# EAGLE schematic Circuito (EAGLE 9.6.2)
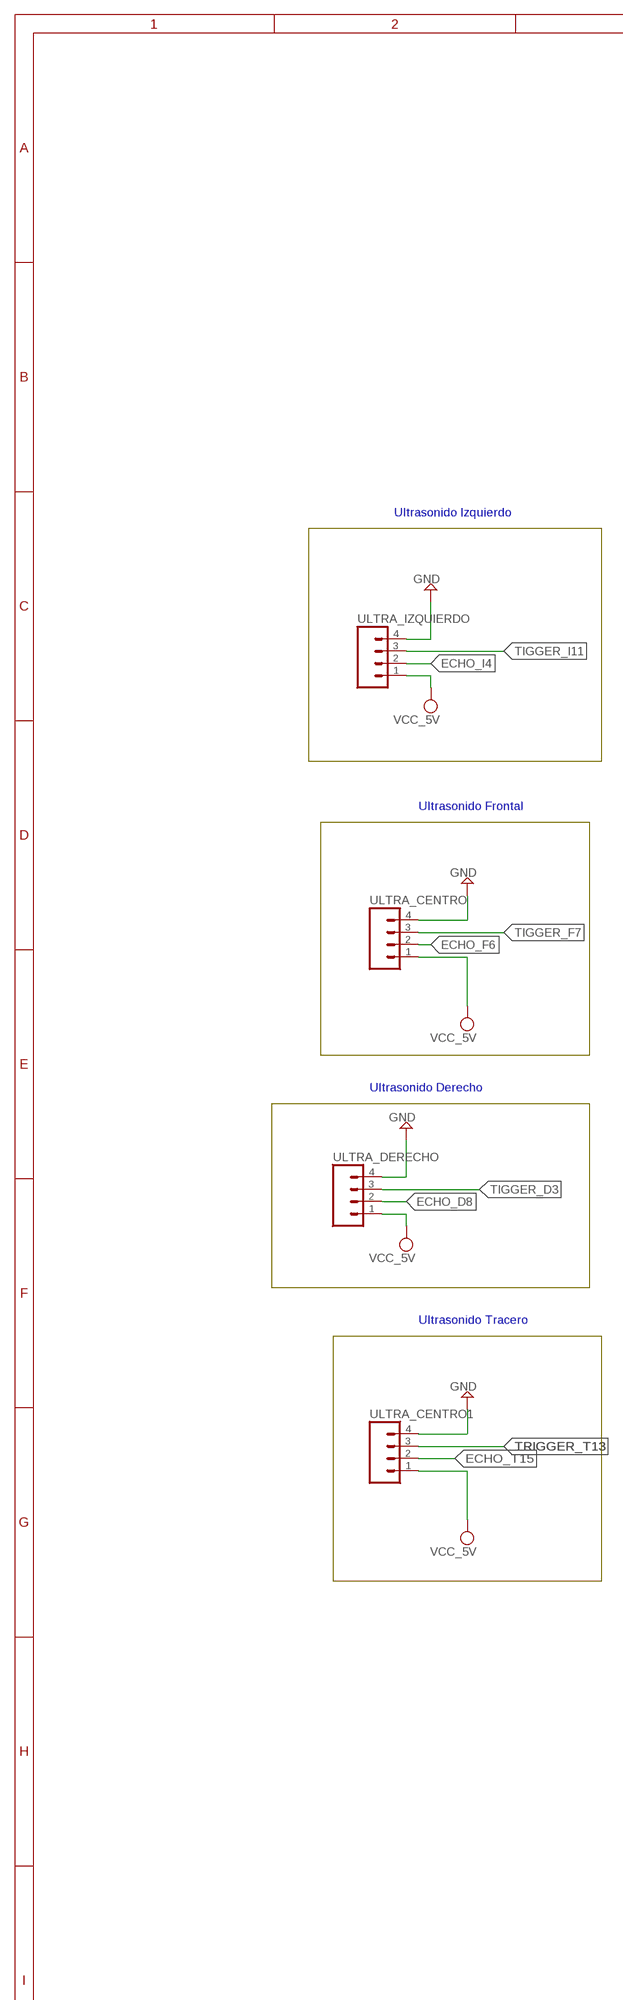
[diagram p0: schematic, sheet 1, part 1 of 2]
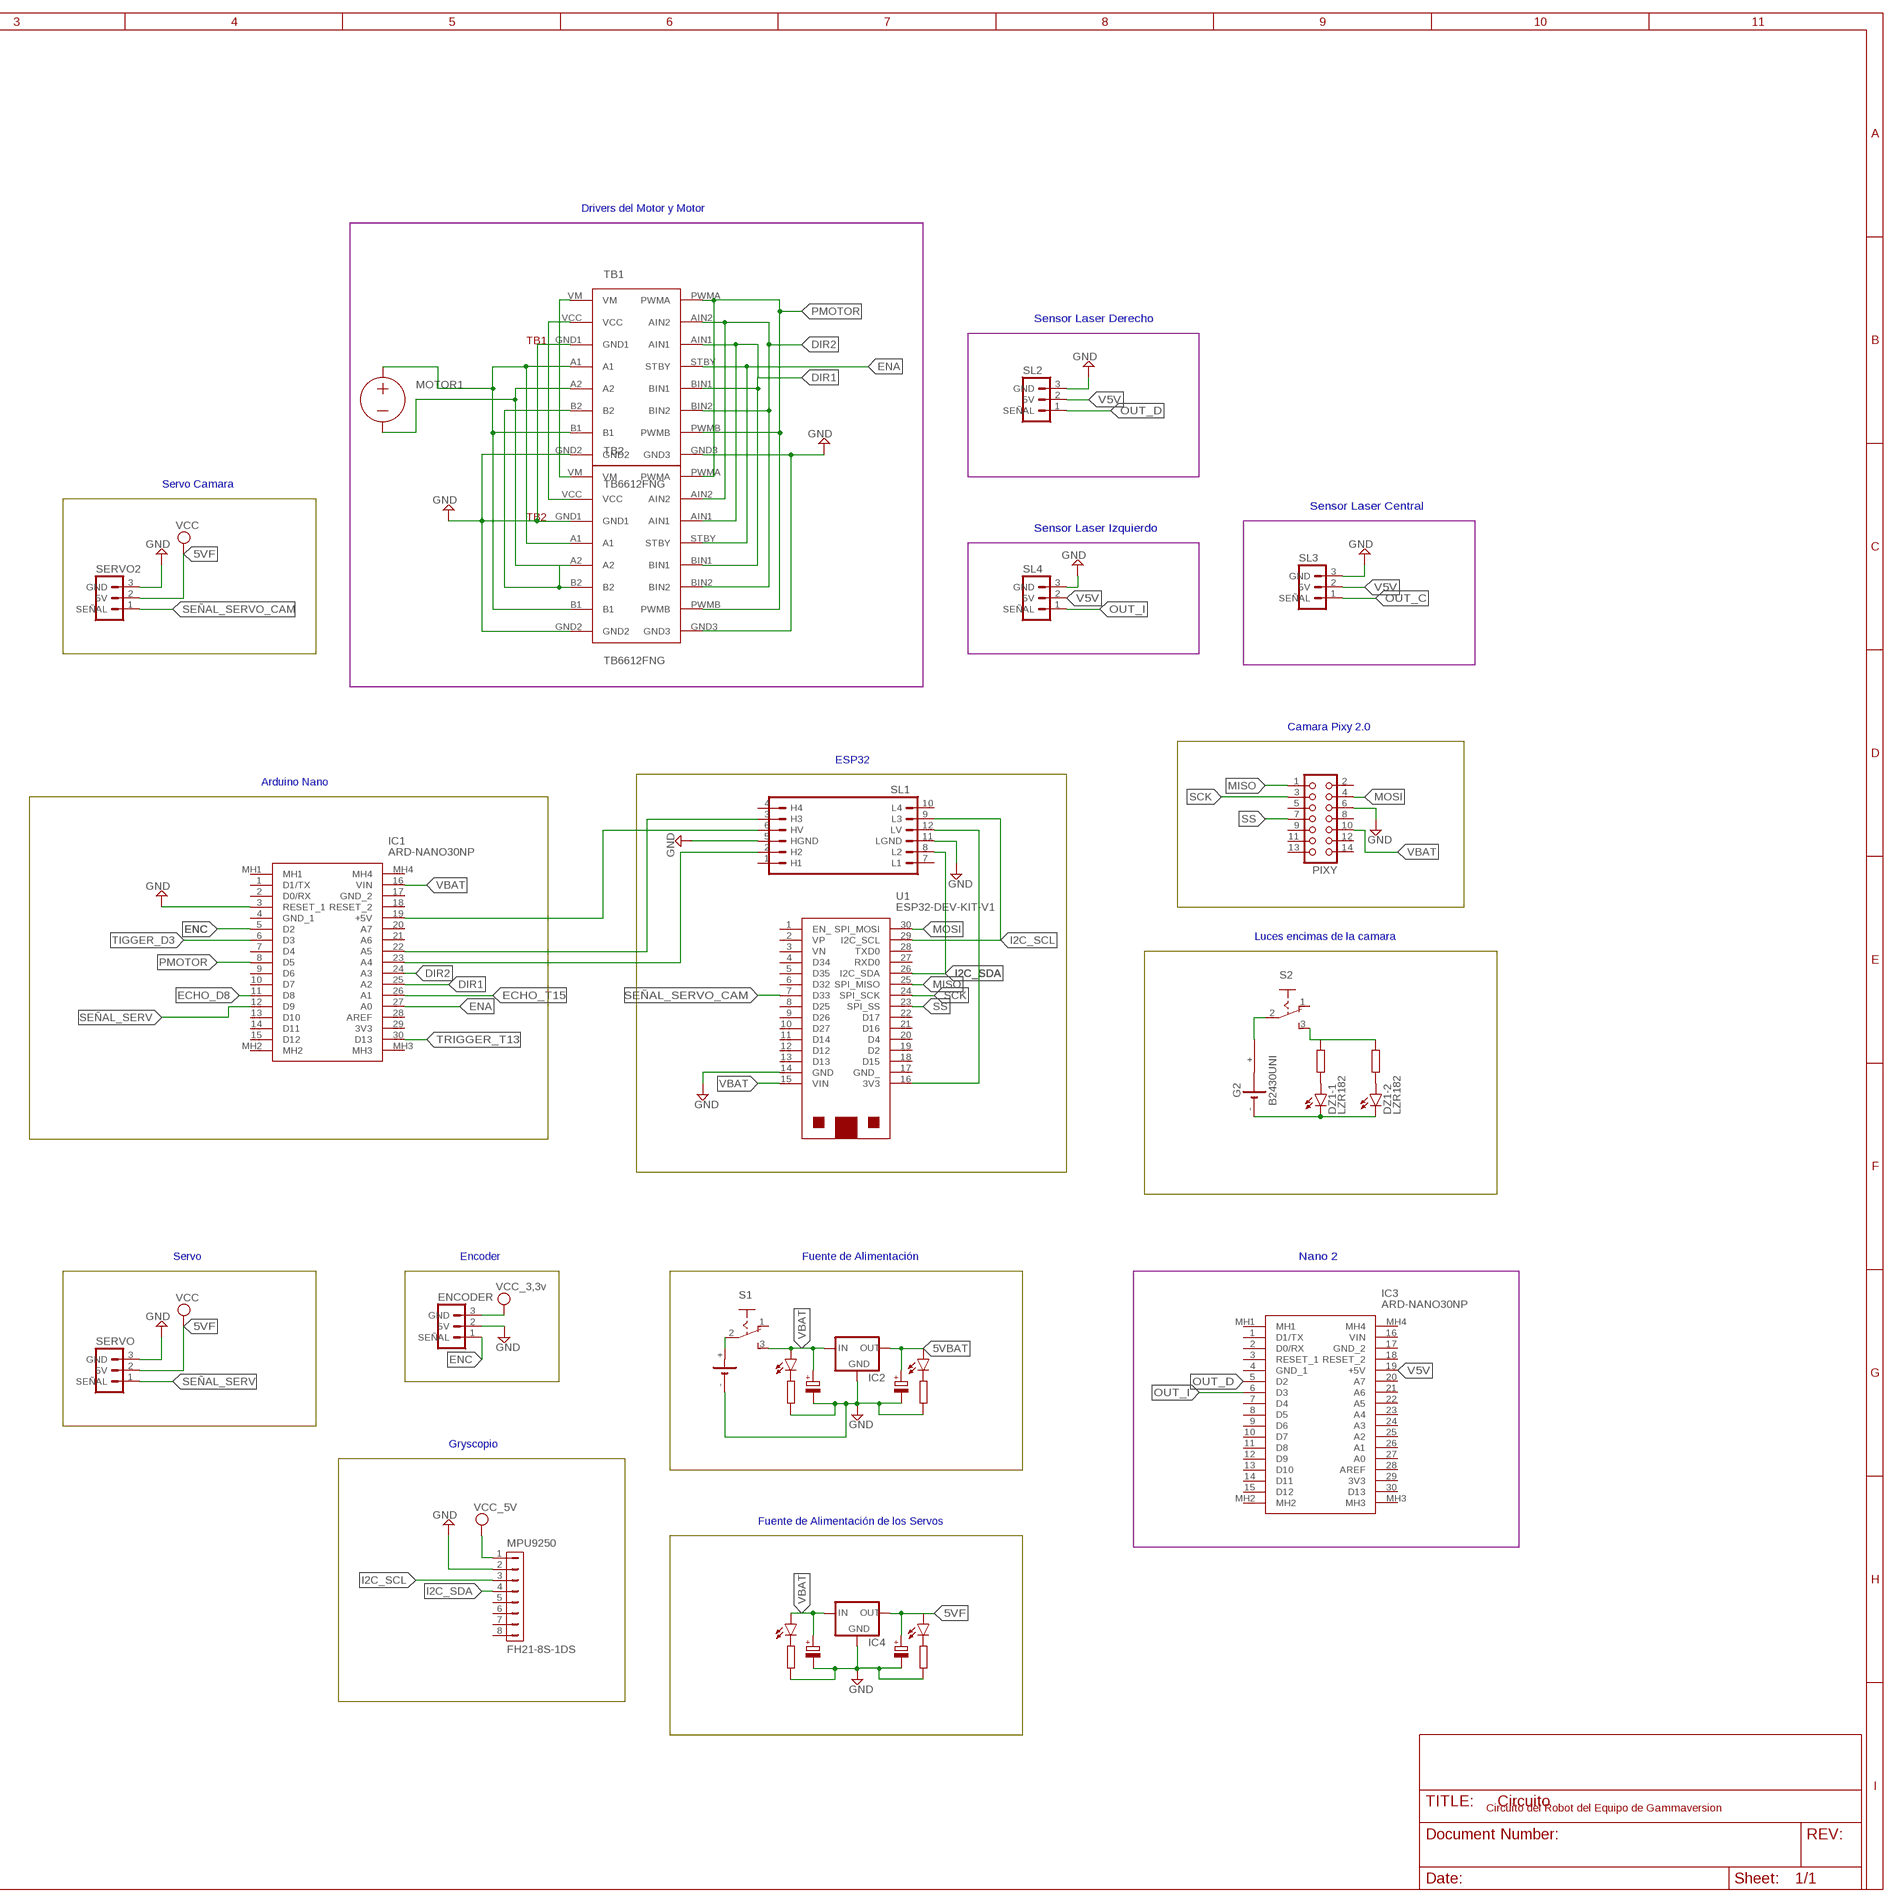
[diagram p1: schematic, sheet 1, part 2 of 2]

## Parts
D1  U57X32  [U57X32]
D2  U57X32  [U57X32]
D3  U57X32  [U57X32]
D4  U57X32  [U57X32]
DZ1  LZR182  [LZR182]
ENCODER  M03  [03P]
G1  CH291-1220LF  [CH291-1220LF]
G2  B2430UNI  [B2430UNI]
IC1  ARD-NANO30NP  [ARDNANO30NP]
IC2  78XXS  [78XXS]
IC3  ARD-NANO30NP  [ARDNANO30NP]
IC4  78XXS  [78XXS]
MOTOR1  VOLTAGE  (no package)
MPU9250  FH21-8S-1DS  [FH21-8S-1DS]
PIXY  CON14  [CON14]
S1  M251  [M251]
S2  M251  [M251]
SERVO  CON_SERVO  [03P]
SERVO2  CON_SERVO  [03P]
SL1  I2C_LEVELCONVERTER  [12P]
SL2  M03  [03P]
SL3  M03  [03P]
SL4  M03  [03P]
TB1  TB6612FNG  [TB6612FNG]
TB2  TB6612FNG  [TB6612FNG]
U1  ESP32-DEV-KIT-V1  [DIP2600W100P254L5400H500Q38N]
ULTRA_CENTRO  M04  [04P]
ULTRA_CENTRO1  M04  [04P]
ULTRA_DERECHO  M04  [04P]
ULTRA_IZQUIERDO  M04  [04P]

## Nets
5VBAT: D2.A D4.A IC2.OUT IC4.OUT
DIR1: IC1.25(A2) TB1.AIN1 TB1.BIN1 TB2.AIN1 TB2.BIN1
DIR2: IC1.24(A3) TB1.AIN2 TB1.BIN2 TB2.AIN2 TB2.BIN2
ECHO_D8: ULTRA_DERECHO.2
ECHO_F6: ULTRA_CENTRO.2
ECHO_I4: ULTRA_IZQUIERDO.2
ECHO_T15: ULTRA_CENTRO1.2
ENA: IC1.27(A0) TB1.STBY TB2.STBY
ENC: ENCODER.1(SEÑAL) IC1.5(D2)
GND: ENCODER.2(5V) G1.- IC1.3(RESET_1) IC2.GND IC4.GND MPU9250.2 PIXY.6(GND) SERVO2.3(GND) SERVO.3(GND) SL1.5(HGND) SL1.11(LGND) SL2.3(GND) SL3.3(GND) SL4.3(GND) TB1.GND1 TB1.GND2 TB1.GND3 TB2.GND1 TB2.GND2 TB2.GND3 U1.14(GND) ULTRA_CENTRO1.4 ULTRA_CENTRO.4 ULTRA_DERECHO.4 ULTRA_IZQUIERDO.4
I2C_SCL: MPU9250.3 SL1.9(L3) U1.29(I2C_SCL)
I2C_SDA: MPU9250.4 SL1.8(L2) U1.26(I2C_SDA)
MISO: PIXY.1(SPI_MISO) U1.25(SPI_MISO)
MOSI: PIXY.4(SPI_MOSI) U1.30(SPI_MOSI)
N$1: DZ1.K1(-1:C) DZ1.K2(-2:C) G2.-
N$2: IC1.6(D3)
N$3: IC1.22(A5) SL1.3(H3)
N$4: IC1.11(D8)
N$5: IC1.23(A4) SL1.2(H2)
N$8: IC1.30(D13)
N$10: G2.+ S2.2(P)
N$11: SL1.12(LV) U1.16(3V3)
N$12: IC1.19(+5V) SL1.6(HV)
N$13: S2.3(S)
N$14: IC1.26(A1)
N$15: IC3.6(D3)
N$16: U1.7(D33)
N$17: TB1.VM TB2.VM
N$18: TB1.VCC TB2.VCC
N$21: MOTOR1.- TB1.A2 TB1.B2 TB2.A2 TB2.B2
N$23: MOTOR1.+ TB1.A1 TB1.B1 TB2.A1 TB2.B1
OUT_C: SL3.1(SEÑAL)
OUT_D: SL2.1(SEÑAL)
OUT_I: SL4.1(SEÑAL)
PMOTOR: IC1.8(D5) TB1.PWMA TB1.PWMB TB2.PWMA TB2.PWMB
SCK: PIXY.3(SPI_SCK) U1.24(SPI_SCK)
SEÑAL_SERV: IC1.12(D9) SERVO.1(SEÑAL)
SEÑAL_SERVO_CAM: SERVO2.1(SEÑAL)
SS: PIXY.7(SPI_SS) U1.23(SPI_SS)
TIGGER_D3: ULTRA_DERECHO.3
TIGGER_F7: ULTRA_CENTRO.3
TIGGER_I11: ULTRA_IZQUIERDO.3
TRIGGER_T13: ULTRA_CENTRO1.3
V5V: SL2.2(5V) SL3.2(5V)
VBAT: D1.A D3.A G1.+ IC1.16(VIN) IC2.IN IC4.IN PIXY.10(VIN) S1.2(P) S1.3(S) U1.15(VIN)
VCC_5V_SERVO: ENCODER.3(GND) MPU9250.1 SERVO2.2(5V) SERVO.2(5V) ULTRA_CENTRO1.1 ULTRA_CENTRO.1 ULTRA_DERECHO.1 ULTRA_IZQUIERDO.1 ; supply symbol labelled VCC_3,3v, VCC_5V, VCC
Unconnected: D1.K(C) D2.K(C) D3.K(C) D4.K(C) DZ1.A1(-1:A) DZ1.A2(-2:A) G2.+@1(+) G2.+@2(+) G2.+@3(+) G2.+@4(+) G2.-@1(-) IC1.1(D1/TX) IC1.2(D0/RX) IC1.4(GND_1) IC1.7(D4) IC1.9(D6) IC1.10(D7) IC1.13(D10) IC1.14(D11) IC1.15(D12) IC1.17(GND_2) IC1.18(RESET_2) IC1.20(A7) IC1.21(A6) IC1.28(AREF) IC1.29(3V3) IC1.MH1 IC1.MH2 IC1.MH3 IC1.MH4 IC3.1(D1/TX) IC3.2(D0/RX) IC3.3(RESET_1) IC3.4(GND_1) IC3.5(D2) IC3.7(D4) IC3.8(D5) IC3.9(D6) IC3.10(D7) IC3.11(D8) IC3.12(D9) IC3.13(D10) IC3.14(D11) IC3.15(D12) IC3.16(VIN) IC3.17(GND_2) IC3.18(RESET_2) IC3.19(+5V) IC3.20(A7) IC3.21(A6) IC3.22(A5) IC3.23(A4) IC3.24(A3) IC3.25(A2) IC3.26(A1) IC3.27(A0) IC3.28(AREF) IC3.29(3V3) IC3.30(D13) IC3.MH1 IC3.MH2 IC3.MH3 IC3.MH4 MPU9250.5 MPU9250.6 MPU9250.7 MPU9250.8 PIXY.2(5V) PIXY.5(12C_SCL) PIXY.8(ANAOUT) PIXY.9(I2C_SDA) PIXY.11 PIXY.12 PIXY.13 PIXY.14 S1.1(O) S2.1(O) SL1.1(H1) SL1.4(H4) SL1.7(L1) SL1.10(L4) SL4.2(5V) U1.2(VP) U1.3(VN) U1.4(D34) U1.5(D35) U1.6(D32) U1.8(D25) U1.9(D26) U1.10(D27) U1.11(D14) U1.12(D12) U1.18(D15) U1.19(D2) U1.20(D4) U1.21(D16) U1.22(D17) U1.27(RXD0) U1.28(TXD0)

## Notes on the sheet
- Drivers del Motor y Motor
- Sensor Laser Derecho
- Ultrasonido Izquierdo
- Servo Camara
- Sensor Laser Central
- Sensor Laser Izquierdo
- Ultrasonido Frontal | Camara Pixy 2.0
- ESP32
- Arduino Nano
- Luces encimas de la camara
- Ultrasonido Derecho
- Ultrasonido Tracero
- Servo | Encoder | Fuente de Alimentación | Nano 2
- Gryscopio
- Fuente de Alimentación de los Servos
- Circuito del Robot del Equipo de Gammaversion

## Power pins joined to a net without a drawn wire
D13: U1.13(D13)
EN_: U1.1(EN_)
GND_: U1.17(GND_)

## Library data of the parts
D1-D4 = led:U57X32: LED rectangle, 5.7 x 3.2 mm
DZ1 = led:LZR182: LED BLOCK 2 LEDs, Siemens
ENCODER SL2-SL4 = con-amp-quick:M03: AMP QUICK CONNECTOR; OC_FARNELL: unknown; OC_NEWARK: unknown
G1 = battery:CH291-1220LF: Battery Holder, SMT, 12mm multicomp PART NO. CH291-1220LF Source: Data sheet <http://www.farnell.com/datasheets/1505860.pdf>
G2 = battery:B2430UNI: LI BATTERY
IC1 IC3 = ARD-NANO30NP:ARD-NANO30NP: Development Boards & Kits - AVR Arduino Nano 3.1 W/ATMEGA328 NO-PIN Source: Datasheet <http://www.mouser.com/datasheet/2/595/Arduino_Nano3_0-220057.pdf>; DESCRIPTION: Development Boards & Kits - AVR Arduino Nano 3.1 W/ATMEGA328 NO-PIN; HEIGHT: 5mm; MANUFACTURER_NAME: Gravitech; MANUFACTURER_PART_NUMBER: ARD-NANO30NP; MOUSER_PART_NUMBER: 992-ARD-NANO30NP; MOUSER_PRICE-STOCK: https://www.mouser.co.uk/ProductDetail/Gravitech/ARD-NANO30NP?qs=Vxac6xGyzPlh7in3DWNTbQ%3D%3D
IC2 IC4 = v-reg:78XXS: VOLTAGE REGULATOR
MOTOR1 = ngspice-simulation:VOLTAGE: Independent Voltage Source, either DC, AC, PULSE, SINE, PWL, EXP, or SFFM; VALUE: 0V
MPU9250 = con-hirose:FH21-8S-1DS: FPC CONNECTOR Source: con-hirose.lbr from Bob Starr <rtzaudio@mindspring.com>; OC_FARNELL: unknown; OC_NEWARK: unknown
PIXY = PixyConnector:CON14: CONNECTOR; OC_FARNELL: unknown; OC_NEWARK: unknown
S1 S2 = switch:M251: SLIDING SWITCH Mors, distributor Buerklin, 11G702
SERVO SERVO2 = con-amp-quick:CON_SERVO: AMP QUICK CONNECTOR; OC_FARNELL: unknown; OC_NEWARK: unknown
SL1 = con-amp-quick:I2C_LEVELCONVERTER: AMP QUICK CONNECTOR; OC_FARNELL: unknown; OC_NEWARK: unknown
TB1 TB2 = TB6612FNG:TB6612FNG
U1 = ESP32-DevKitV1:ESP32-DEV-KIT-V1: WiFi / 802.11 Development Tools ESP32 General Development Kit, ESP-WROOM-32 on the board Source: Datasheet <http://esp-idf.readthedocs.io/en/latest/get-started/get-started-devkitc.html>; DESCRIPTION: WiFi / 802.11 Development Tools ESP32 General Development Kit, ESP-WROOM-32 on the board; HEIGHT: 5mm; MANUFACTURER_NAME: Espressif Systems; MANUFACTURER_PART_NUMBER: ESP32-DevKitC
ULTRA_CENTRO ULTRA_CENTRO1 ULTRA_DERECHO ULTRA_IZQUIERDO = con-amp-quick:M04: AMP QUICK CONNECTOR; OC_FARNELL: unknown; OC_NEWARK: unknown